# Altium schematic sheet 02. POWER SUPPLY.SchDoc
size A4
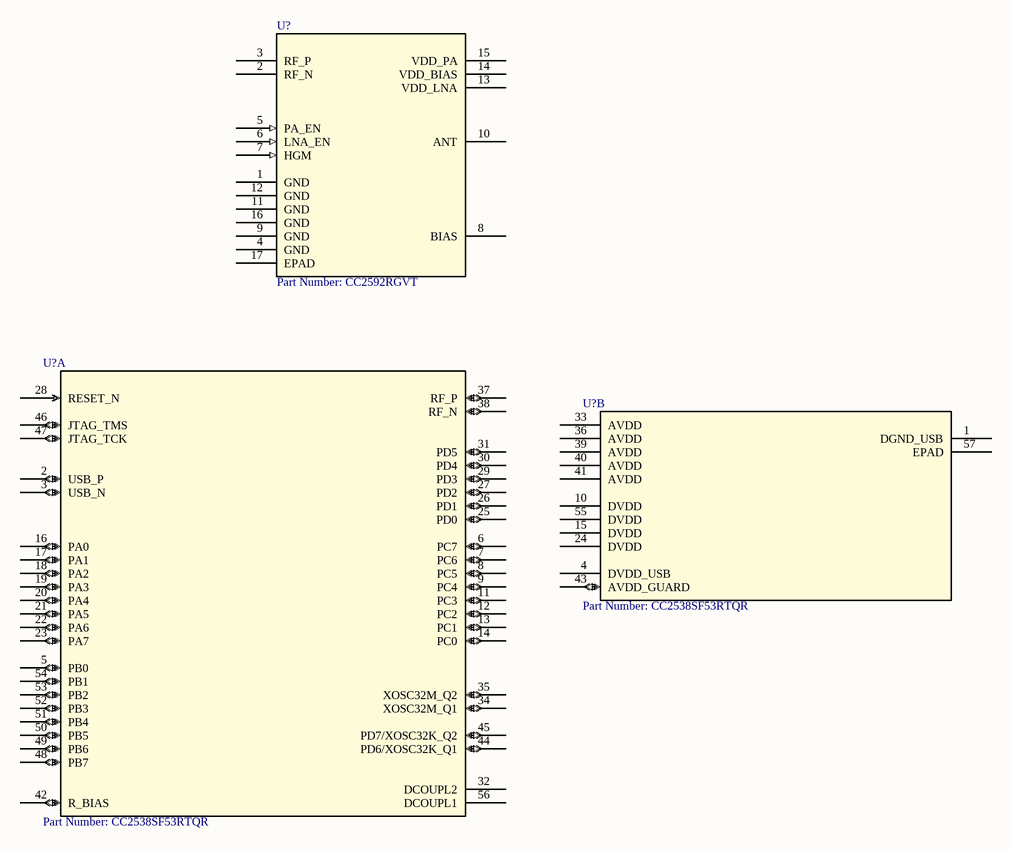
[diagram p0: 02. POWER SUPPLY.SchDoc]

## Parts
(Parts that share a designator on the sheet are numbered #1, #2 ... from top to bottom, then left to right.)
U?#1  Part Number: CC2592RGVT  [QFN16_2P16X2P16]
U?#2  Part Number: CC2538SF53RTQR  [QFN56_6P7X6P7]  (part B of 2)
U?#3  Part Number: CC2538SF53RTQR  [QFN56_6P7X6P7]  (part A of 2)

## Nets

Not connected (* = marked no-connect by the designer): U?#1 1(GND) 2(RF_N) 3(RF_P) 4(GND) 5(PA_EN) 6(LNA_EN) 7(HGM) 8(BIAS) 9(GND) 10(ANT) 11(GND) 12(GND) 13(VDD_LNA) 14(VDD_BIAS) 15(VDD_PA) 16(GND) 17(EPAD); U?#2 1(DGND_USB) 4(DVDD_USB) 10(DVDD) 15(DVDD) 24(DVDD) 33(AVDD) 36(AVDD) 39(AVDD) 40(AVDD) 41(AVDD) 43(AVDD_GUARD) 55(DVDD) 57(EPAD); U?#3 2(USB_P) 3(USB_N) 5(PB0) 6(PC7) 7(PC6) 8(PC5) 9(PC4) 11(PC3) 12(PC2) 13(PC1) 14(PC0) 16(PA0) 17(PA1) 18(PA2) 19(PA3) 20(PA4) 21(PA5) 22(PA6) 23(PA7) 25(PD0) 26(PD1) 27(PD2) 28(RESET_N) 29(PD3) 30(PD4) 31(PD5) 32(DCOUPL2) 34(XOSC32M_Q1) 35(XOSC32M_Q2) 37(RF_P) 38(RF_N) 42(R_BIAS) 44(PD6/XOSC32K_Q1) 45(PD7/XOSC32K_Q2) 46(JTAG_TMS) 47(JTAG_TCK) 48(PB7) 49(PB6) 50(PB5) 51(PB4) 52(PB3) 53(PB2) 54(PB1) 56(DCOUPL1)

## Library data of the parts
U?#1 = CC2592RGVT: No Description Available; Vendor: Texas Instruments; Built_By: EMA_UL_Team; Manufacturer_Part_Number: CC2592RGVT; Copyright: Copyright (C) 2018 Accelerated Designs. All rights reserved; RefDes: RefDes; Type: DEV; Value: Value
U?#2 U?#3 = CC2538SF53RTQR: IC RF TxRx + MCU 802.15.4 6LoWPAN, Zigbee® 2.4GHz 56-VFQFN Exposed Pad; Vendor: Texas Instruments; Built_By: EMA_UL_Team; Manufacturer_Part_Number: CC2538SF53RTQR; Copyright: Copyright (C) 2018 Accelerated Designs. All rights reserved; RefDes: RefDes; Type: DEV; Value: Value